# EAGLE design biestable (EAGLE 9.2.2)
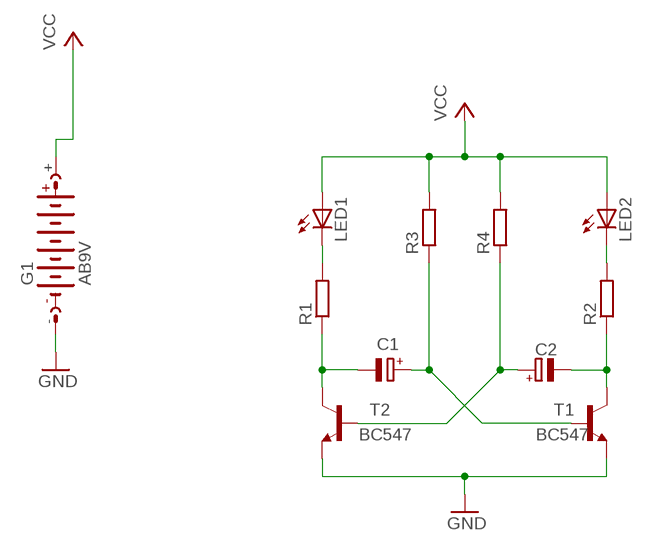
[diagram p0: schematic, sheet 1]

## Parts
C1  CPOL-EUE1.8-4  [E1,8-4]
C2  CPOL-EUE1.8-4  [E1,8-4]
G1  AB9V  [AB9V]
LED1  LED5MM  [LED5MM]
LED2  LED5MM  [LED5MM]
R1  R0207/10  [0207/10]
R2  R0207/10  [0207/10]
R3  R0207/10  [0207/10]
R4  R0207/10  [0207/10]
T1  BC547  [TO92]
T2  BC547  [TO92]

## Nets
GND: G1.- T1.1(E) T2.1(E)
N$1: LED1.K(C) R1.2
N$2: LED2.K(C) R2.2
N$4: C1.- R1.1 T2.3(C)
N$5: C1.+ R3.1 T1.2(B)
N$6: C2.+ R4.1 T2.2(B)
N$7: C2.- R2.1 T1.3(C)
VCC: G1.+ LED1.A LED2.A R3.2 R4.2

## Library data of the parts
C1 C2 = rcl:CPOL-EU: POLARIZED CAPACITOR, European symbol; SPICEPREFIX: C
G1 = battery:AB9V: 9-V BATTERY CLIP
LED1 LED2 = adafruit:LED: LED OSRAM: - CHIPLED LG R971, LG N971, LY N971, LG Q971, LY Q971, LO R971, LY R971 LH N974, LH R974 LS Q976, LO Q976, LY Q976 LO Q996 - Hyper CHIPLED LW Q18S LB Q993, LB Q99A, LB R99A - SideLED LS A670, LO A670, LY A670, LG A670, LP A670 LB A673, LV A673, LT A673, LW A673 LH A674 LY A675 LS A676, LA A676, LO A676, LY A676, LW A676 LS A679, LY A679, LG A679 - Hyper Micro SIDELED® LS Y876, LA Y876, LO Y876, LY Y876 LT Y87S - SmartLED LW L88C, LW L88S LB L89C, LB L89S, LG L890 LS L89K, LO L89K, LY L89K LS L896, LA L896, LO L896, LY L896 - TOPLED LS T670, LO T670, LY T670, LG T670, LP T670 LSG T670, LSP T670, LSY T670, LOP T670, LYG T670 LG T671, LOG T671, LSG T671 LB T673, LV T673, LT T673, LW T673 LH T674 LS T676, LA T676, LO T676, LY T676, LB T676, LH T676, LSB T676, LW T676 LB T67C, LV T67C, LT T67C, LS T67K, LO T67K, LY T67K, LW E67C LS E67B, LA E67B, LO E67B, LY E67B, LB E67C, LV E67C, LT E67C LW T67C LS T679, LY T679, LG T679 LS T770, LO T770, LY T770, LG T770, LP T770 LB T773, LV T773, LT T773, LW T773 LH T774 LS E675, LA E675, LY E675, LS T675 LS T776, LA T776, LO T776, LY T776, LB T776 LHGB T686 LT T68C, LB T68C - Hyper Mini TOPLED® LB M676 - Mini TOPLED Santana® LG M470 LS M47K, LO M47K, LY M47K Source: http://www.osram.convergy.de/
R1-R4 = eagle-ltspice:R: RESISTOR, European symbol; SPICEMODEL: NONE; SPICEPREFIX: R
T1 T2 = transistor:BC547: NPN TRANSISTOR

## Board
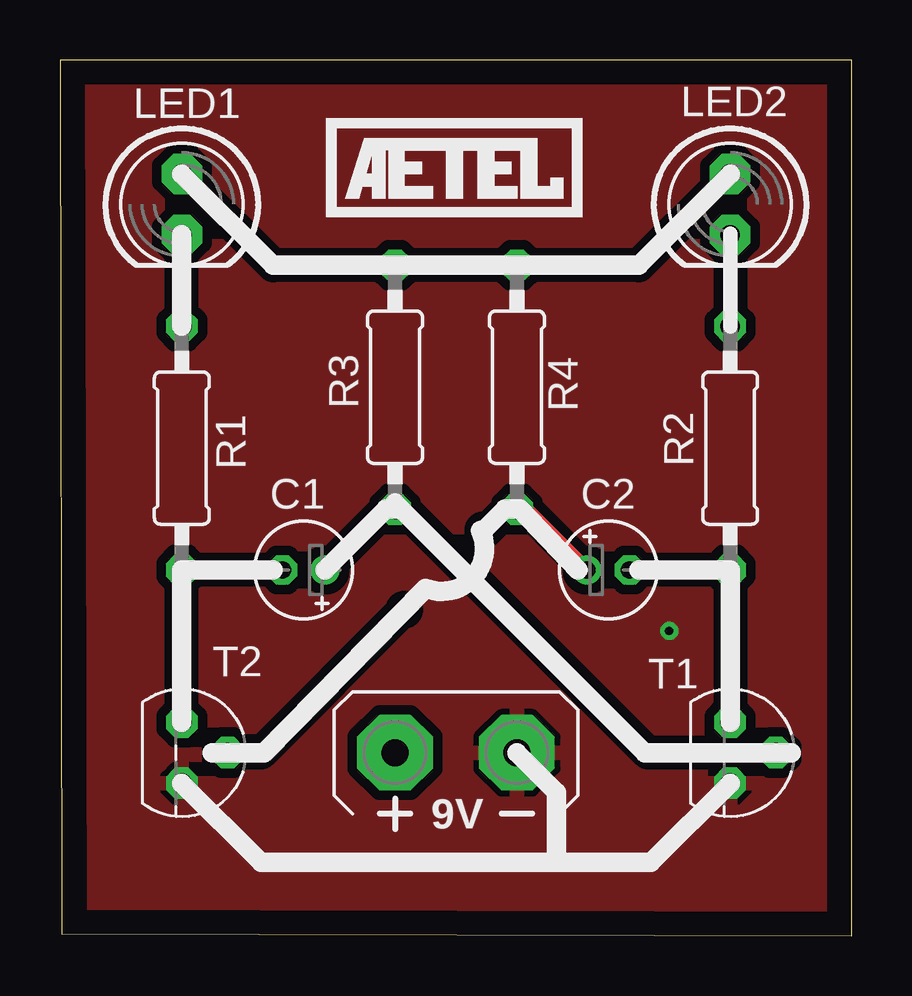
[diagram p1: board, top side]
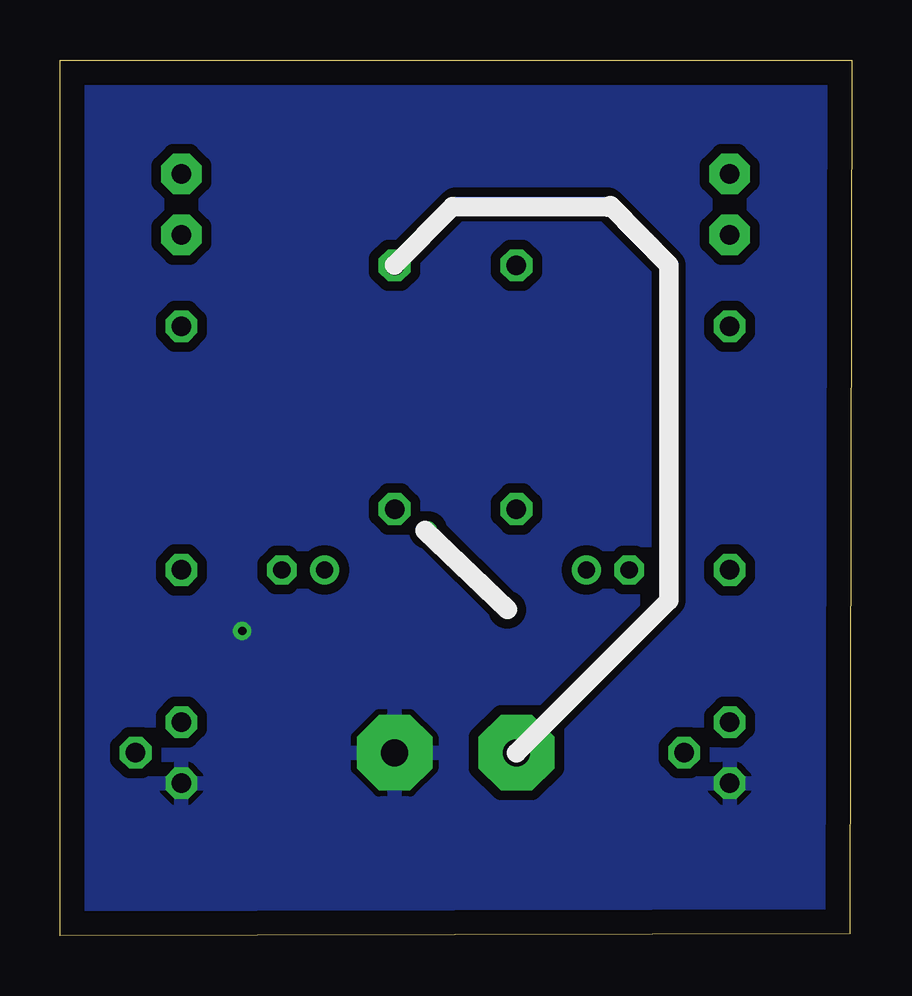
[diagram p2: board, bottom side, seen from below]

Size 33 x 36.5 mm. Coordinates in mm from the lower left corner, seen from the top.
Outline: 0.06,0.07 33,0 33,36.5 0,36.5 0.06,0.07
Copper layers (1*16): Top 0.035mm / dielectric 1.5mm / Bottom 0.035mm
Design rules "default": minimum track width 6mil, minimum drill 0.35mm, track to track 6mil, track to pad 6mil, pad to pad 6mil, via to via 6mil, smd to smd 6mil, copper to edge 40mil, drill to drill 6mil, minimum pad ring 10mil, minimum via ring 8mil, stop-mask expansion 4mil, vias tented up to drill 0mil, thermal gap 10mil

### Footprints (pad centres in the part's own frame; a part is rotated, then mirrored left to right if it is on the bottom)
E1,8-4 = drill 0.711 pad 1.168: + -0.889,0 | drill 0.711 pad 1.168 octagon: - 0.889,0
AB9V = drill 1.118 pad 3.15 octagon: + 0,2.54; - 0,-2.54
LED5MM = drill 0.813 pad 1.676 octagon: A -1.27,0; K 1.27,0
0207/10 = drill 0.813 octagon: 1 -5.08,0; 2 5.08,0
TO92 = drill 0.813 octagon: 1 1.27,0; 2 0,1.905; 3 -1.27,0

### Placement (x,y rotation side)
C1  10.16,15.24 180 top
C2  22.86,15.24 0 top
G1  16.51,7.62 90 top
LED1  5.08,30.48 270 top
LED2  27.94,30.48 270 top
R1  5.08,20.32 90 top
R2  27.94,20.32 90 top
R3  13.97,22.86 90 top
R4  19.05,22.86 90 top
T1  27.94,7.62 270 top
T2  5.08,7.62 270 top

### Tracks (layer width: path | path; a pad name or v marks a point on that pad's centre or on a via)
GND  (via drill 0.35)
  other vias: 25.4,12.7
  pour Top (isolate 0.406): 1.04,1.15 1.04,35.56 31.75,35.56 31.75,1.15
  pour Bottom (isolate 0.406): 1.04,1.15 1.04,35.62 31.75,35.62 31.75,1.15
N$1
  Top 0.61: R1.2 LED1.K
N$2
  Top 0.61: LED2.K R2.2
N$4
  Top 0.61: T2.3 R1.1 C1.-
N$5
  Top 0.61: C1.+ 13.97,18.16 | 13.97,18.16 R3.1 | T1.2 24.51,7.62 13.97,18.16
N$6  (via drill 0.35)
  Top 0.61: C2.+ 19.05,18.16 | 19.05,18.16 R4.1 | 19.05,18.16 17.78,16.89 v17.65,16.89 | v14.35,13.59 8.38,7.62 T2.2
  Bottom 0.61: v17.65,16.89 v14.35,13.59
N$7
  Top 0.61: T1.3 R2.1 C2.-
VCC
  Top 0.61: LED1.A 8.89,27.94 R3.2 R4.2 24.13,27.94 LED2.A
  Bottom 0.61: R4.2 16.51,30.48 10.16,30.48 7.62,27.94 7.62,13.97 G1.+

### Text on the board
tNames: C:/Users/cansi/Desktop/aetel.bmp